# EAGLE schematic Main board V6.0 (EAGLE 6.5.0)

## Sheet 1 of 5: ACS
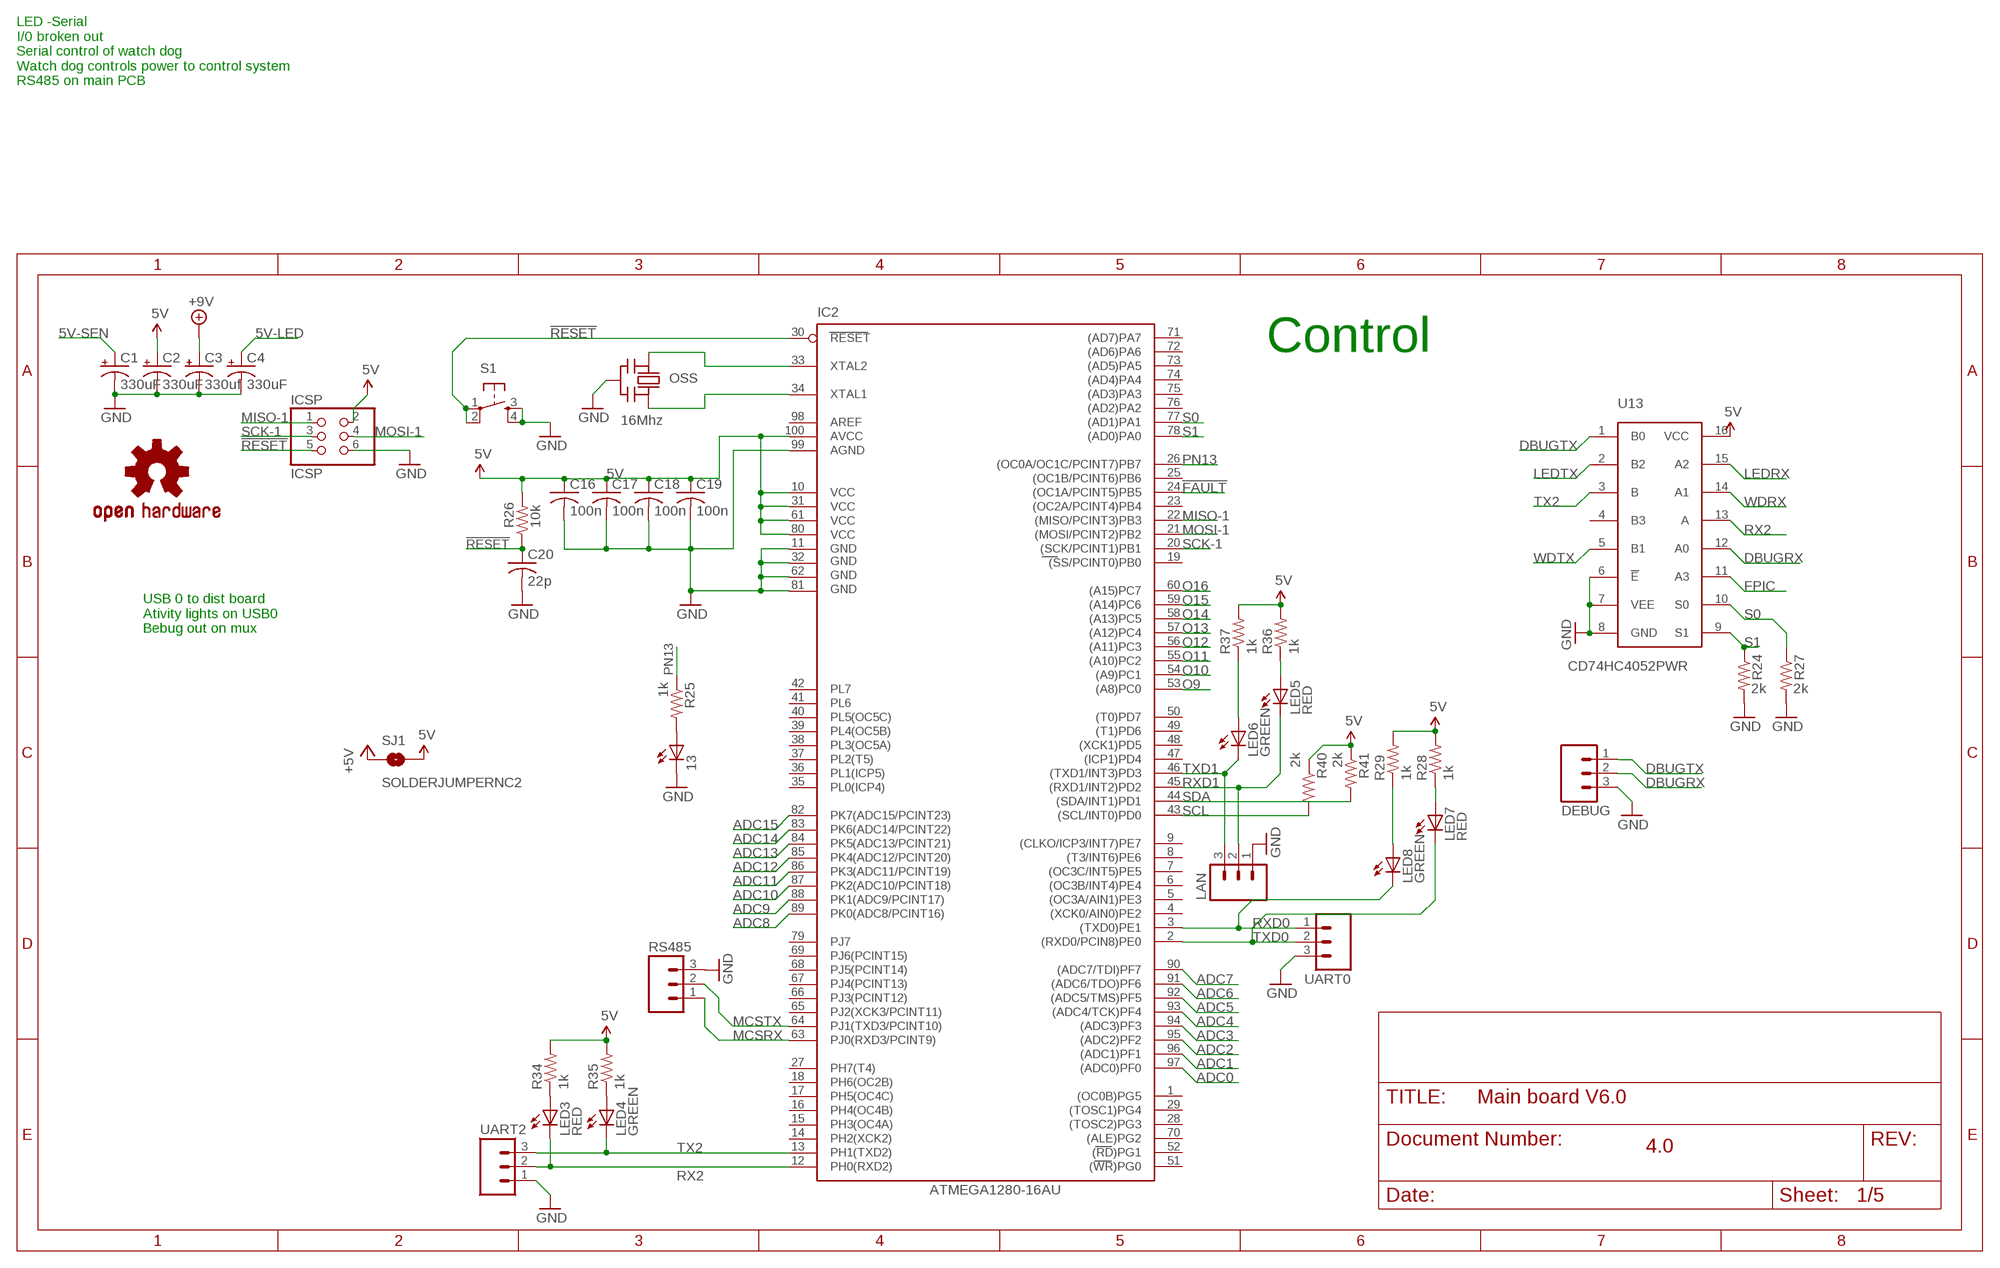
[diagram p0: schematic, sheet 1]

### Parts
13  LEDCHIP-LED0805  [CHIP-LED0805]
C1  330uF  CPOL-US140CLH-0810  [140CLH-0810]
C2  330uF  CPOL-US140CLH-0810  [140CLH-0810]
C3  330uf  CPOL-US140CLH-0810  [140CLH-0810]
C4  330uF  CPOL-US140CLH-0810  [140CLH-0810]
C16  100n  C-USC0805  [C0805]
C17  100n  C-USC0805  [C0805]
C18  100n  C-USC0805  [C0805]
C19  100n  C-USC0805  [C0805]
C20  22p  C-USC0805  [C0805]
DEBUG  M03LOCK  [1X03_LOCK]
IC2  ATMEGA1280-16AU  [TQFP100]
ICSP  ICSP  PINHD-2X3  [2X03]
LAN  M03LOCK  [1X03_LOCK]
LED3  RED  LEDCHIP-LED0805  [CHIP-LED0805]
LED4  GREEN  LEDCHIP-LED0805  [CHIP-LED0805]
LED5  RED  LEDCHIP-LED0805  [CHIP-LED0805]
LED6  GREEN  LEDCHIP-LED0805  [CHIP-LED0805]
LED7  RED  LEDCHIP-LED0805  [CHIP-LED0805]
LED8  GREEN  LEDCHIP-LED0805  [CHIP-LED0805]
OSS  16Mhz  CERMOSCILL-AWCSR  [AWCSR]
R24  2k  R-US_R0805  [R0805]
R25  1k  R-US_R0805  [R0805]
R26  10k  R-US_R0805  [R0805]
R27  2k  R-US_R0805  [R0805]
R28  1k  R-US_R0805  [R0805]
R29  1k  R-US_R0805  [R0805]
R34  1k  R-US_R0805  [R0805]
R35  1k  R-US_R0805  [R0805]
R36  1k  R-US_R0805  [R0805]
R37  1k  R-US_R0805  [R0805]
R40  2k  R-US_R0805  [R0805]
R41  2k  R-US_R0805  [R0805]
RS485  M03LOCK  [1X03_LOCK]
S1  TAC_SWITCHSMD  [TACTILE_SWITCH_SMD]
SJ1  SOLDERJUMPERNC2  [SJ_2S-NOTRACE]
U13  CD74HC4052PWR  [TSSOP-16]
U$3  OSHW-LOGOL  [OSHW-LOGO-L]
UART0  M03LOCK  [1X03_LOCK]
UART2  M03POLAR  [MOLEX-1X3]

### Nets
5V: C2.+ C16.1 C17.1 C18.1 C19.1 IC2.10(VCC) IC2.31(VCC1) IC2.61(VCC2) IC2.80(VCC3) IC2.100(AVCC) ICSP.2 R26.2 R28.2 R29.2 R34.2 R35.2 R36.2 R37.2 R40.1 R41.1 SJ1.2 U13.16(VCC) ; also sheet 4,5
5V-LED: C4.+ ; also sheet 2,5
5V-SEN: C1.+ ; also sheet 5
!FAULT: IC2.24((OC1A/PCINT5)PB5)
!RESET: C20.1 IC2.30(RESET) ICSP.5 R26.1 S1.1 S1.2
+5V: SJ1.1 ; also sheet 2
+9V: C3.+ ; also sheet 5
ADC0: IC2.97((ADC0)PF0) ; also sheet 5
ADC1: IC2.96((ADC1)PF1) ; also sheet 5
ADC2: IC2.95((ADC2)PF2) ; also sheet 5
ADC3: IC2.94((ADC3)PF3) ; also sheet 5
ADC4: IC2.93((ADC4/TCK)PF4) ; also sheet 5
ADC5: IC2.92((ADC5/TMS)PF5) ; also sheet 5
ADC6: IC2.91((ADC6/TDO)PF6) ; also sheet 5
ADC7: IC2.90((ADC7/TDI)PF7) ; also sheet 5
ADC8: IC2.89(PK0(ADC8/PCINT16)) ; also sheet 5
ADC9: IC2.88(PK1(ADC9/PCINT17)) ; also sheet 5
ADC10: IC2.87(PK2(ADC10/PCINT18)) ; also sheet 5
ADC11: IC2.86(PK3(ADC11/PCINT19)) ; also sheet 5
ADC12: IC2.85(PK4(ADC12/PCINT20)) ; also sheet 5
ADC13: IC2.84(PK5(ADC13/PCINT21)) ; also sheet 5
ADC14: IC2.83(PK6(ADC14/PCINT22)) ; also sheet 5
ADC15: IC2.82(PK7(ADC15/PCINT23)) ; also sheet 5
DBUGRX: DEBUG.2 U13.12(A0)
DBUGTX: DEBUG.1 U13.1(B0)
FPIC: U13.11(A3) ; also sheet 5
GND: 13.C C1.- C2.- C3.- C4.- C16.2 C17.2 C18.2 C19.2 C20.2 DEBUG.3 IC2.11(GND) IC2.32(GND1) IC2.62(GND2) IC2.81(GND3) IC2.99(AGND) ICSP.6 LAN.1 OSS.2(GND) R24.2 R27.2 RS485.3 S1.3 S1.4 U13.6(!E) U13.7(VEE) U13.8(GND) UART0.3 UART2.1 ; also sheet 2,3,4,5
LEDRX: U13.15(A2) ; also sheet 2
LEDTX: U13.2(B2) ; also sheet 2
MCSRX: IC2.63(PJ0(RXD3/PCINT9)) RS485.1 ; also sheet 5
MCSTX: IC2.64(PJ1(TXD3/PCINT10)) RS485.2 ; also sheet 5
MISO-1: IC2.22((MISO/PCINT3)PB3) ICSP.1
MOSI-1: IC2.21((MOSI/PCINT2)PB2) ICSP.4
N$2: 13.A R25.2
N$6: IC2.34(XTAL1) OSS.3(OUT)
N$7: IC2.33(XTAL2) OSS.1(IN)
N$52: LED8.A R29.1
N$69: LED4.A R35.1
N$71: LED3.A R34.1
N$73: LED7.A R28.1
N$74: LED6.A R37.1
N$75: LED5.A R36.1
O9: IC2.53((A8)PC0)
O10: IC2.54((A9)PC1)
O11: IC2.55((A10)PC2)
O12: IC2.56((A11)PC3)
O13: IC2.57((A12)PC4)
O14: IC2.58((A13)PC5)
O15: IC2.59((A14)PC6)
O16: IC2.60((A15)PC7)
PN13: IC2.26((OC0A/OC1C/PCINT7)PB7) R25.1 ; also sheet 4
RX2: IC2.12(PH0(RXD2)) LED3.C U13.13(A) UART2.2
RXD0: IC2.3((TXD0)PE1) LED8.C UART0.1 ; also sheet 5
RXD1: IC2.45((RXD1/INT2)PD2) LAN.2 LED5.C ; also sheet 3
S0: IC2.77((AD1)PA1) R27.1 U13.10(S0)
S1: IC2.78((AD0)PA0) R24.1 U13.9(S1)
SCK-1: IC2.20((SCK/PCINT1)PB1) ICSP.3
SCL: IC2.43((SCL/INT0)PD0) R40.2 ; also sheet 5
SDA: IC2.44((SDA/INT1)PD1) R41.2 ; also sheet 5
TX2: IC2.13(PH1(TXD2)) LED4.C U13.3(B) UART2.3
TXD0: IC2.2((RXD0/PCIN8)PE0) LED7.C UART0.2 ; also sheet 5
TXD1: IC2.46((TXD1/INT3)PD3) LAN.3 LED6.C ; also sheet 3
WDRX: U13.14(A1) ; also sheet 4
WDTX: U13.5(B1) ; also sheet 4
Unconnected: IC2.1((OC0B)PG5) IC2.4((XCK0/AIN0)PE2) IC2.5((OC3A/AIN1)PE3) IC2.6((OC3B/INT4)PE4) IC2.7((OC3C/INT5)PE5) IC2.8((T3/INT6)PE6) IC2.9((CLKO/ICP3/INT7)PE7) IC2.14(PH2(XCK2)) IC2.15(PH3(OC4A)) IC2.16(PH4(OC4B)) IC2.17(PH5(OC4C)) IC2.18(PH6(OC2B)) IC2.19((SS/PCINT0)PB0) IC2.23((OC2A/PCINT4)PB4) IC2.25((OC1B/PCINT6)PB6) IC2.27(PH7(T4)) IC2.28((TOSC2)PG3) IC2.29((TOSC1)PG4) IC2.35(PL0(ICP4)) IC2.36(PL1(ICP5)) IC2.37(PL2(T5)) IC2.38(PL3(OC5A)) IC2.39(PL4(OC5B)) IC2.40(PL5(OC5C)) IC2.41(PL6) IC2.42(PL7) IC2.47((ICP1)PD4) IC2.48((XCK1)PD5) IC2.49((T1)PD6) IC2.50((T0)PD7) IC2.51((WR)PG0) IC2.52((RD)PG1) IC2.65(PJ2(XCK3/PCINT11)) IC2.66(PJ3(PCINT12)) IC2.67(PJ4(PCINT13)) IC2.68(PJ5(PCINT14)) IC2.69(PJ6(PCINT15)) IC2.70((ALE)PG2) IC2.71((AD7)PA7) IC2.72((AD6)PA6) IC2.73((AD5)PA5) IC2.74((AD4)PA4) IC2.75((AD3)PA3) IC2.76((AD2)PA2) IC2.79(PJ7) IC2.98(AREF) U13.4(B3)

### Notes on the sheet
- LED -Serial
  I/0 broken out
  Serial control of watch dog
  Watch dog controls power to control system
  RS485 on main PCB
- Control
- USB 0 to dist board
  Ativity lights on USB0
  Bebug out on mux
- 4.0

## Sheet 2 of 5
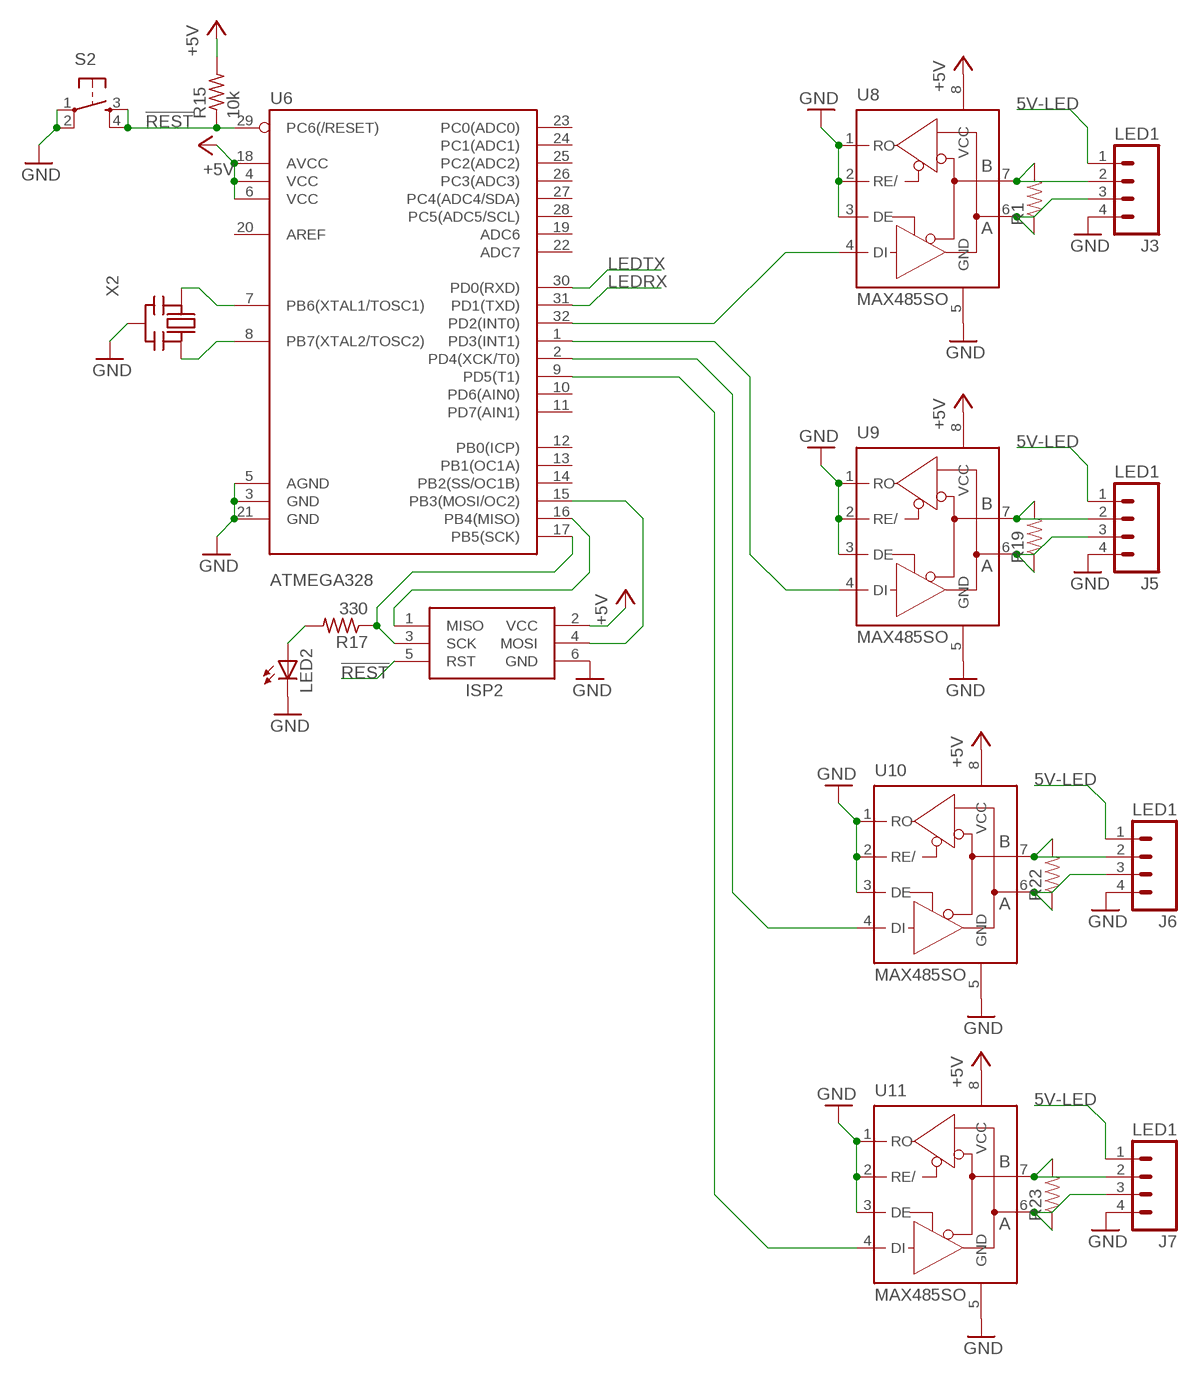
[diagram p1: schematic, sheet 2]

### Parts
ISP2  AVRISP-6  [AVRISP]
J3  LED1  EUROMAG-4  [M4]
J5  LED1  EUROMAG-4  [M4]
J6  LED1  EUROMAG-4  [M4]
J7  LED1  EUROMAG-4  [M4]
LED2  LEDCHIPLED_0805  [CHIPLED_0805]
R1  RESISTOR0805-RES  [0805]
R15  10k  R-US_R0805  [R0805]
R17  330  R-US_R0805  [R0805]
R19  RESISTOR0805-RES  [0805]
R22  RESISTOR0805-RES  [0805]
R23  RESISTOR0805-RES  [0805]
S2  TAC_SWITCHPTH  [TACTILE-PTH]
U6  ATMEGA328  ATMEGA168  [TQFP32-08]
U8  MAX485SO  [SO08]
U9  MAX485SO  [SO08]
U10  MAX485SO  [SO08]
U11  MAX485SO  [SO08]
X2  CERMOSCILL-AWCSR  [AWCSR]

### Nets
5V-LED: J3.1 J5.1 J6.1 J7.1 ; also sheet 1,5
!REST: ISP2.5(RST) R15.1 S2.3 S2.4 U6.29(PC6(/RESET))
+5V: ISP2.2(VCC) R15.2 U6.4(VCC) U6.6(VCC) U6.18(AVCC) U8.8(VCC) U9.8(VCC) U10.8(VCC) U11.8(VCC) ; also sheet 1
DFDFD: ISP2.1(MISO) U6.16(PB4(MISO))
GND: ISP2.6(GND) J3.4 J5.4 J6.4 J7.4 LED2.C S2.1 S2.2 U6.3(GND) U6.5(AGND) U6.21(GND) U8.1(RO) U8.2(RE/) U8.3(DE) U8.5(GND) U9.1(RO) U9.2(RE/) U9.3(DE) U9.5(GND) U10.1(RO) U10.2(RE/) U10.3(DE) U10.5(GND) U11.1(RO) U11.2(RE/) U11.3(DE) U11.5(GND) X2.2(GND) ; also sheet 1,3,4,5
LEDRX: U6.31(PD1(TXD)) ; also sheet 1
LEDTX: U6.30(PD0(RXD)) ; also sheet 1
N$21: ISP2.3(SCK) R17.1 U6.17(PB5(SCK))
N$22: ISP2.4(MOSI) U6.15(PB3(MOSI/OC2))
N$23: LED2.A R17.2
N$24: U6.7(PB6(XTAL1/TOSC1)) X2.1(IN)
N$25: U6.8(PB7(XTAL2/TOSC2)) X2.3(OUT)
N$28: J3.2 R1.2 U8.7(B)
N$29: J3.3 R1.1 U8.6(A)
N$30: J5.2 R19.2 U9.7(B)
N$31: J5.3 R19.1 U9.6(A)
N$32: J6.2 R22.2 U10.7(B)
N$34: J6.3 R22.1 U10.6(A)
N$35: J7.2 R23.2 U11.7(B)
N$36: J7.3 R23.1 U11.6(A)
N$37: U6.32(PD2(INT0)) U8.4(DI)
N$38: U6.1(PD3(INT1)) U9.4(DI)
N$39: U6.2(PD4(XCK/T0)) U10.4(DI)
N$41: U6.9(PD5(T1)) U11.4(DI)
Unconnected: U6.10(PD6(AIN0)) U6.11(PD7(AIN1)) U6.12(PB0(ICP)) U6.13(PB1(OC1A)) U6.14(PB2(SS/OC1B)) U6.19(ADC6) U6.20(AREF) U6.22(ADC7) U6.23(PC0(ADC0)) U6.24(PC1(ADC1)) U6.25(PC2(ADC2)) U6.26(PC3(ADC3)) U6.27(PC4(ADC4/SDA)) U6.28(PC5(ADC5/SCL))

## Sheet 3 of 5: CTS
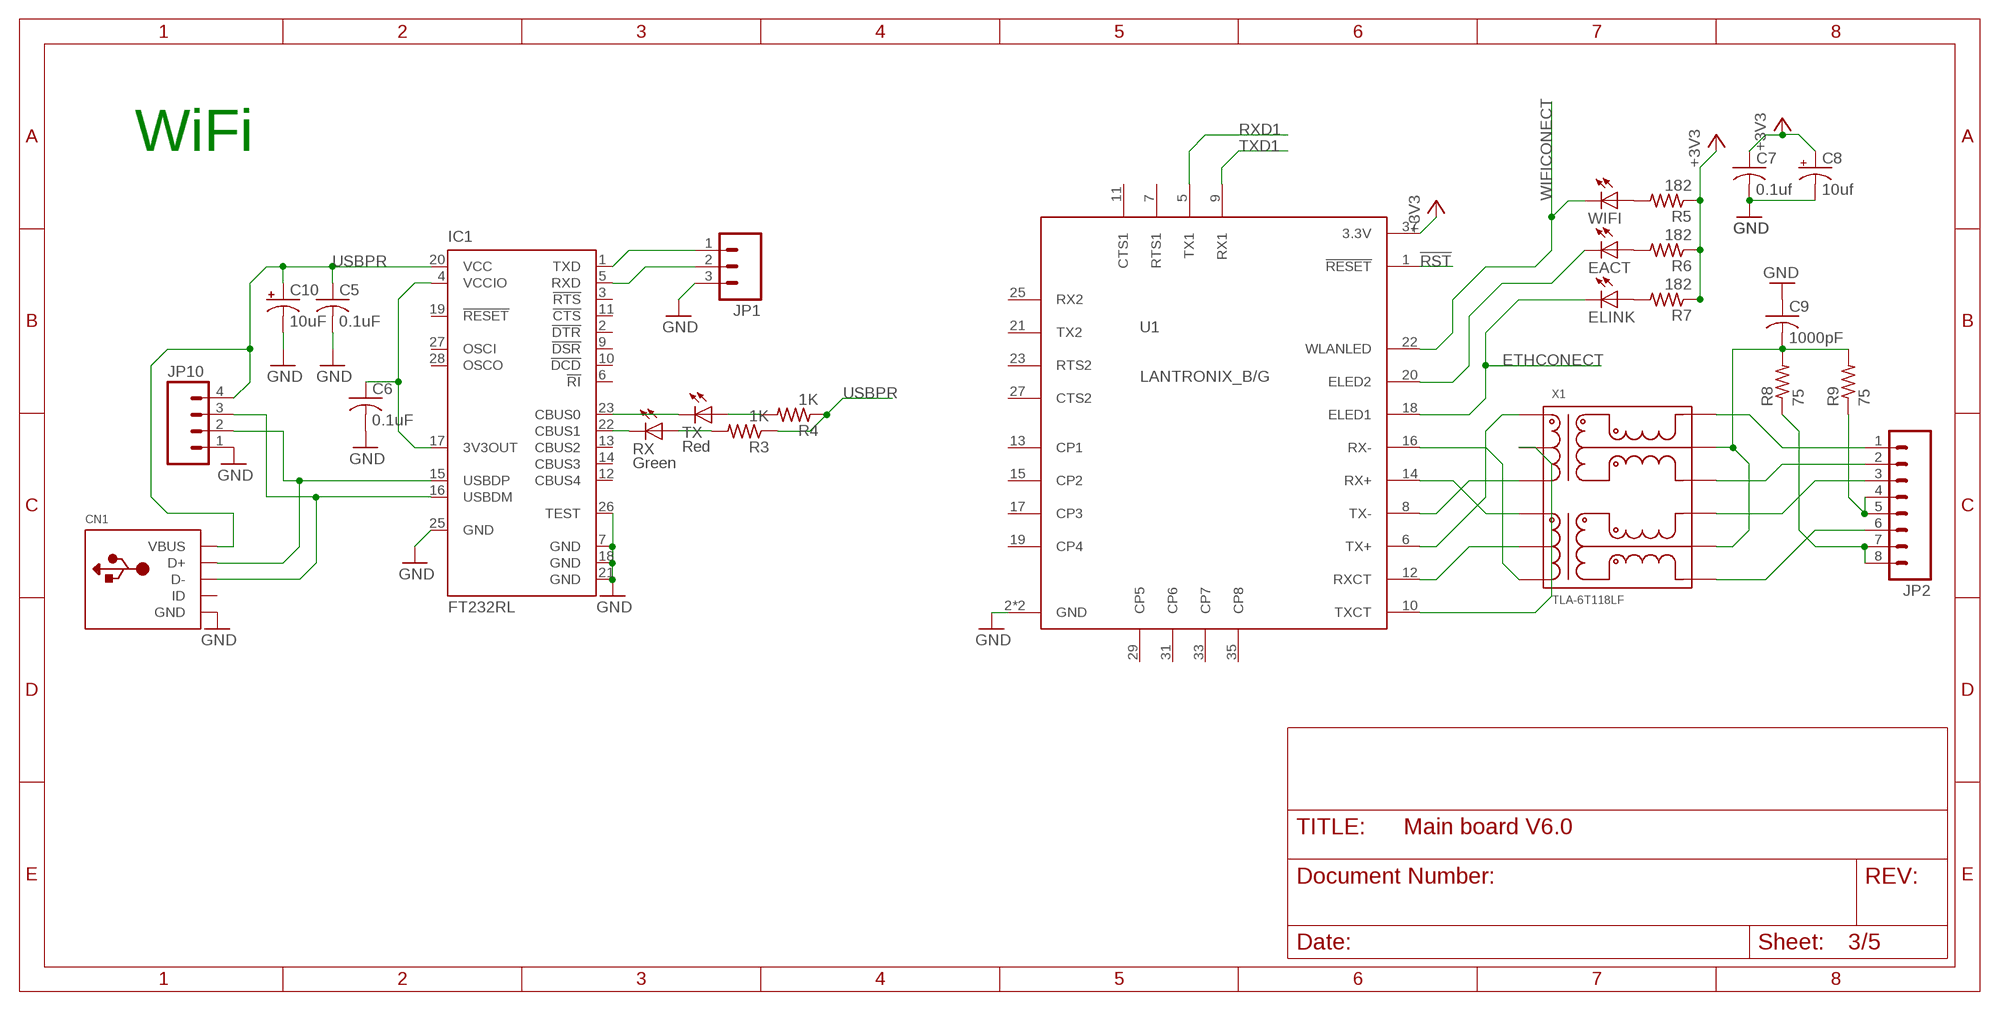
[diagram p2: schematic, sheet 3]

### Parts
C5  0.1uF  C-USC0805K  [C0805K]
C6  0.1uF  C-USC0805K  [C0805K]
C7  0.1uf  C-USC0805K  [C0805K]
C8  10uf  CAP_POL3528  [EIA3528]
C9  1000pF  C-USC1812  [C1812]
C10  10uF  CAP_POL3528-KIT  [EIA3528-KIT]
CN1  USBMINIB  [USB-MINIB]
EACT  LEDCHIP-LED0805  [CHIP-LED0805]
ELINK  LEDCHIP-LED0805  [CHIP-LED0805]
IC1  FT232RL  [SSOP28]
JP1  M03POLAR  [MOLEX-1X3]
JP2  M08LOCK  [1X08_LOCK]
JP10  M04POLAR  [MOLEX-1X4]
R3  1K  R-US_R0805  [R0805]
R4  1K  R-US_R0805  [R0805]
R5  182  R-US_R0805  [R0805]
R6  182  R-US_R0805  [R0805]
R7  182  R-US_R0805  [R0805]
R8  75  R-US_R0805  [R0805]
R9  75  R-US_R0805  [R0805]
RX  Green  LEDCHIP-LED0805  [CHIP-LED0805]
TX  Red  LEDCHIP-LED0805  [CHIP-LED0805]
U1  LANTRONIX_B/G  LANTRONIX_A/B  [LANA/BTH]
WIFI  LEDCHIP-LED0805  [CHIP-LED0805]
X1  TLA-6T118LF  [SO-16MOD]

### Nets
!RST: U1.1(!RESET)
+3V3: C7.1 C8.A(+) R5.1 R6.1 R7.1 U1.37(3.3V) ; also sheet 5
ETHCONECT: ELINK.C U1.18(ELED1)
GND: C5.2 C6.2 C7.2 C8.C(-) C9.1 C10.C(-) CN1.GND IC1.7(GND) IC1.18(GND) IC1.21(GND) IC1.25(GND) IC1.26(TEST) JP1.3 JP10.1 U1.2(GND) U1.39(GND) ; also sheet 1,2,4,5
N$1: IC1.23(CBUS0) TX.C
N$3: IC1.22(CBUS1) RX.C
N$4: R3.2 RX.A
N$5: CN1.D+ IC1.15(USBDP) JP10.2
N$8: CN1.D- IC1.16(USBDM) JP10.3
N$9: R4.2 TX.A
N$11: IC1.1(TXD) JP1.1
N$12: C6.1 IC1.4(VCCIO) IC1.17(3V3OUT)
N$53: U1.8(TX-) X1.3
N$54: U1.6(TX+) X1.1
N$55: U1.14(RX+) X1.6
N$56: U1.16(RX-) X1.8
N$57: U1.12(RXCT) X1.7
N$58: U1.10(TXCT) X1.2
N$60: JP2.7 JP2.8 R8.1
N$61: JP2.1 X1.16
N$62: JP2.2 X1.14
N$63: JP2.3 X1.11
N$64: JP2.6 X1.9
N$65: C9.2 R8.2 R9.2 X1.10 X1.15
N$66: ELINK.A R7.2
N$67: EACT.A R6.2
N$68: R5.2 WIFI.A
N$70: EACT.C U1.20(ELED2)
N$72: JP2.4 JP2.5 R9.1
N$109: IC1.5(RXD) JP1.2
RXD1: U1.5(TX1) ; also sheet 1
TXD1: U1.9(RX1) ; also sheet 1
USBPR: C5.1 C10.A(+) CN1.VBUS IC1.20(VCC) JP10.4 R3.1 R4.1
WIFICONECT: U1.22(WLANLED) WIFI.C
Unconnected: CN1.ID IC1.2(!DTR) IC1.3(!RTS) IC1.6(!RI) IC1.9(!DSR) IC1.10(!DCD) IC1.11(!CTS) IC1.12(CBUS4) IC1.13(CBUS2) IC1.14(CBUS3) IC1.19(!RESET) IC1.27(OSCI) IC1.28(OSCO) U1.7(RTS1) U1.11(CTS1) U1.13(CP1) U1.15(CP2) U1.17(CP3) U1.19(CP4) U1.21(TX2) U1.23(RTS2) U1.25(RX2) U1.27(CTS2) U1.29(CP5) U1.31(CP6) U1.33(CP7) U1.35(CP8)

### Notes on the sheet
- WiFi

## Sheet 4 of 5: WDS
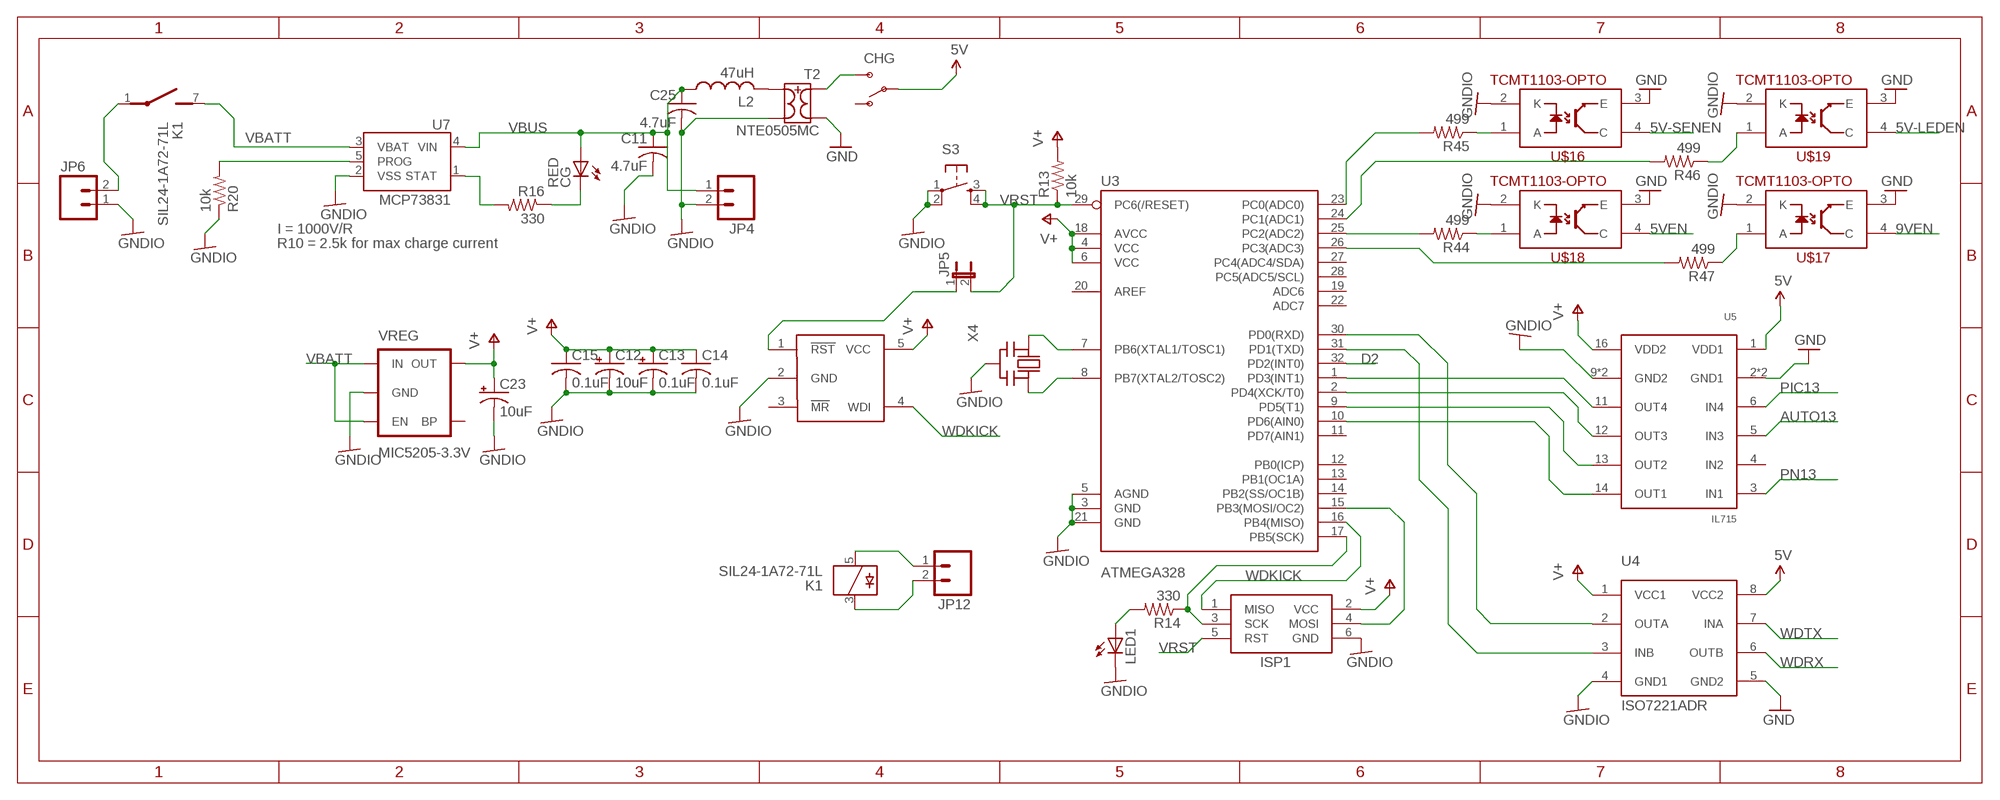
[diagram p3: schematic, sheet 4]

### Parts
C11  4.7uF  C-USC0603  [C0603]
C12  10uF  CPOL-USCT3528  [CT3528]
C13  0.1uF  CPOL-USCT3528  [CT3528]
C14  0.1uF  C-USC0805  [C0805]
C15  0.1uF  C-USC0805  [C0805]
C23  10uF  CPOL-USCT3528  [CT3528]
C25  4.7uF  C-USC0603  [C0603]
CG  RED  LEDSML0805  [SML0805]
CHG  SWITCH-SPSTPTH  [SWITCH-SPDT]
ISP1  AVRISP-6  [AVRISP]
JP4  M021X02_NO_SILK  [1X02_NO_SILK]
JP5  JUMPER-2PTH_LOCK  [1X02_LOCK]
JP6  M02-JST-2MM-SMT  [JST-2-SMD]
JP12  M02POLAR_LOCK  [MOLEX-1X2_LOCK]
K1  SIL24-1A72-71L  35701331  [REED]
L2  47uH  L-USL2012C  [L2012C]
LED1  LEDCHIPLED_0805  [CHIPLED_0805]
R13  10k  R-US_R0805  [R0805]
R14  330  R-US_R0805  [R0805]
R16  330  R-US_R0805  [R0805]
R20  10k  R-US_R0805  [R0805]
R44  499  R-US_R0805  [R0805]
R45  499  R-US_R0805  [R0805]
R46  499  R-US_R0805  [R0805]
R47  499  R-US_R0805  [R0805]
S3  TAC_SWITCHPTH  [TACTILE-PTH]
T2  NTE0505MC  [SO-8FT]
U3  ATMEGA328  ATMEGA168  [TQFP32-08]
U4  ISO7221ADR  [SOIC-8]
U5  IL715  [S016]
U7  MCP73831  [SOT23-5]
U20  MAX823  [SOT23-5L]
U$16  TCMT1103-OPTO  [SSOP-4]
U$17  TCMT1103-OPTO  [SSOP-4]
U$18  TCMT1103-OPTO  [SSOP-4]
U$19  TCMT1103-OPTO  [SSOP-4]
VREG  MIC5205-3.3V  V_REG_LDOSMD  [SOT23-5]
X4  CERMOSCILL-CSTCRG  [CSTCR-G]

### Nets
5V: CHG.2(P) U4.8(VCC2) U5.1(VDD1) ; also sheet 1,5
5V-LEDEN: U$19.4(C) ; also sheet 5
5V-SENEN: U$16.4(C) ; also sheet 5
5VEN: U$18.4(C) ; also sheet 5
9VEN: U$17.4(C) ; also sheet 5
AUTO13: U5.5(IN3) ; also sheet 5
D2: U3.32(PD2(INT0))
GND: T2.1 U4.5(GND2) U5.2(GND1) U5.8(GND1) U$16.3(E) U$17.3(E) U$18.3(E) U$19.3(E) ; also sheet 1,2,3,5
GNDIO: C11.2 C12.- C13.- C14.2 C15.2 C23.- C25.2 ISP1.6(GND) JP4.2 JP6.1 LED1.C R20.1 S3.1 S3.2 T2.7 U3.3(GND) U3.5(AGND) U3.21(GND) U4.4(GND1) U5.9(GND2) U5.15(GND2) U7.2(VSS) U20.2(GND) U$16.2(K) U$17.2(K) U$18.2(K) U$19.2(K) VREG.2(GND) X4.2(GND)
N$16: U3.31(PD1(TXD)) U4.3(INB)
N$18: JP5.1 U20.1(!RST)
N$19: ISP1.3(SCK) R14.1 U3.17(PB5(SCK))
N$20: U3.30(PD0(RXD)) U4.2(OUTA)
N$27: ISP1.4(MOSI) U3.15(PB3(MOSI/OC2))
N$33: R45.2 U3.23(PC0(ADC0))
N$40: L2.2 T2.8
N$42: LED1.A R14.2
N$44: CG.C R16.1
N$45: JP12.1 K1.5
N$46: JP6.2 K1.1(2:P)
N$47: U3.7(PB6(XTAL1/TOSC1)) X4.1(IN)
N$48: U3.8(PB7(XTAL2/TOSC2)) X4.3(OUT)
N$49: U3.2(PD4(XCK/T0)) U5.12(OUT3)
N$50: U3.9(PD5(T1)) U5.13(OUT2)
N$51: U3.10(PD6(AIN0)) U5.14(OUT1)
N$59: CHG.3(S) T2.3
N$76: U3.1(PD3(INT1)) U5.11(OUT4)
N$77: R45.1 U$16.1(A)
N$78: R46.2 U3.24(PC1(ADC1))
N$82: R46.1 U$19.1(A)
N$83: R44.2 U3.25(PC2(ADC2))
N$84: R44.1 U$18.1(A)
N$85: R47.2 U3.26(PC3(ADC3))
N$86: R47.1 U$17.1(A)
N$91: JP12.2 K1.3
PIC13: U5.6(IN4) ; also sheet 5
PN13: U5.3(IN1) ; also sheet 1
PROG: R20.2 U7.5(PROG)
STAT: R16.2 U7.1(STAT)
V+: C12.+ C13.+ C14.1 C15.1 C23.+ ISP1.2(VCC) R13.2 U3.4(VCC) U3.6(VCC) U3.18(AVCC) U4.1(VCC1) U5.16(VDD2) U20.5(VCC) VREG.5(OUT)
VBATT: K1.7(2:S) U7.3(VBAT) VREG.1(IN) VREG.3(EN)
VBUS: C11.1 C25.1 CG.A JP4.1 L2.1 U7.4(VIN)
VRST: ISP1.5(RST) JP5.2 R13.1 S3.3 S3.4 U3.29(PC6(/RESET))
WDKICK: ISP1.1(MISO) U3.16(PB4(MISO)) U20.4(WDI)
WDRX: U4.6(OUTB) ; also sheet 1
WDTX: U4.7(INA) ; also sheet 1
Unconnected: CHG.1(O) U3.11(PD7(AIN1)) U3.12(PB0(ICP)) U3.13(PB1(OC1A)) U3.14(PB2(SS/OC1B)) U3.19(ADC6) U3.20(AREF) U3.22(ADC7) U3.27(PC4(ADC4/SDA)) U3.28(PC5(ADC5/SCL)) U5.4(IN2) U20.3(!MR) VREG.4(BP)

### Notes on the sheet
- I = 1000V/R
- R10 = 2.5k for max charge current

## Sheet 5 of 5: connectors
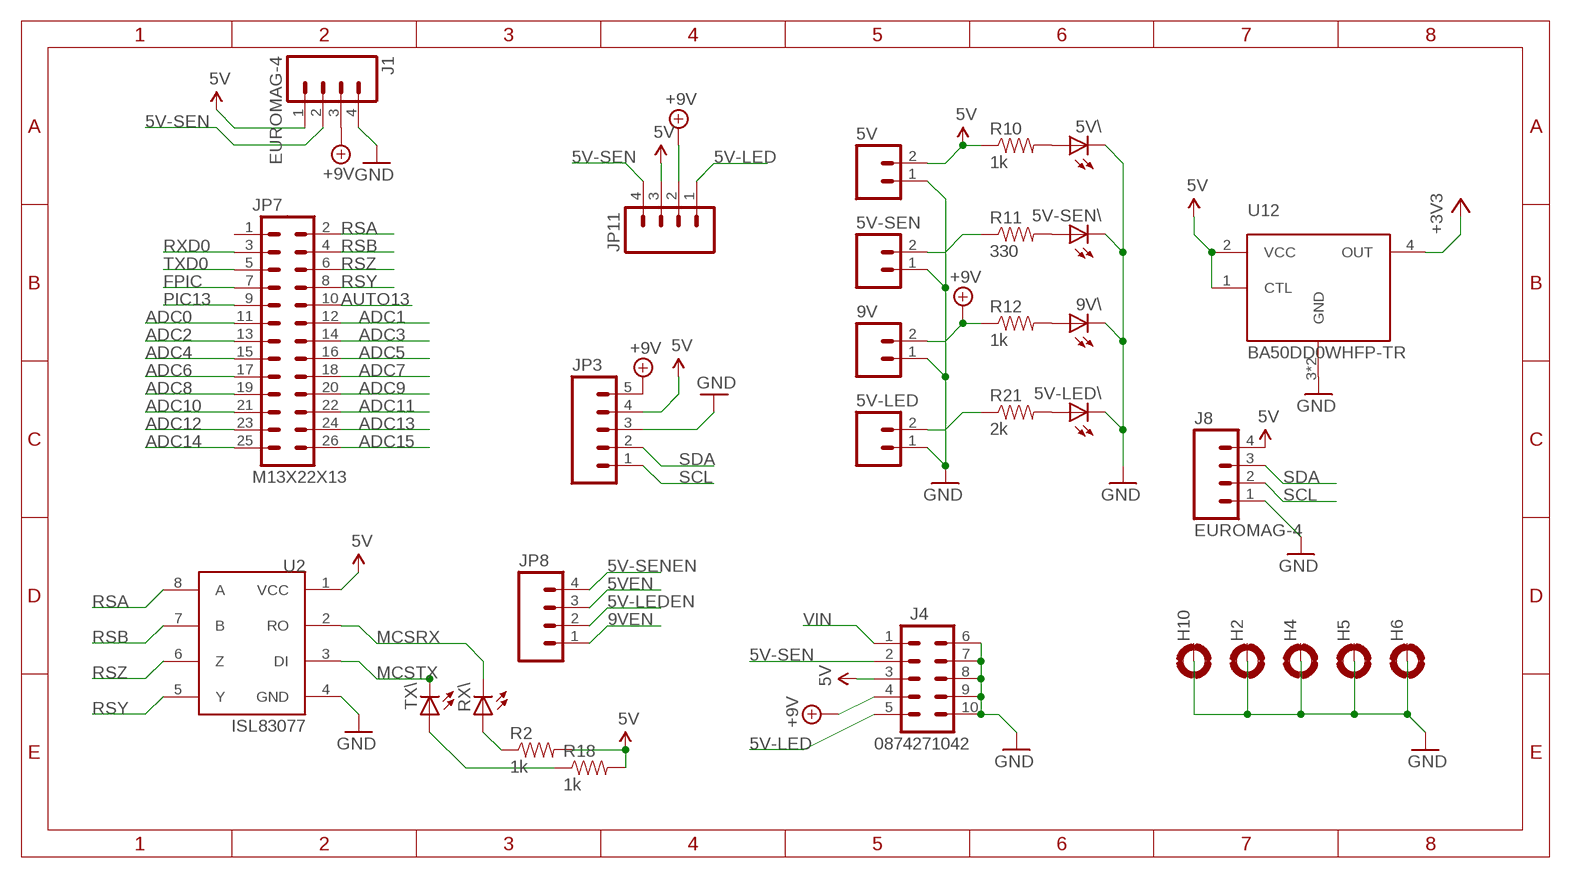
[diagram p4: schematic, sheet 5]

### Parts
5V  EUROMAG-290DEG  [M2]
5V-LED  EUROMAG-290DEG  [M2]
5V-LED\  LEDCHIP-LED0805  [CHIP-LED0805]
5V-SEN  EUROMAG-290DEG  [M2]
5V-SEN\  LEDCHIP-LED0805  [CHIP-LED0805]
5V\  LEDCHIP-LED0805  [CHIP-LED0805]
9V  EUROMAG-290DEG  [M2]
9V\  LEDCHIP-LED0805  [CHIP-LED0805]
H2  MOUNT-PAD-ROUND2.8  [2,8-PAD]
H4  MOUNT-PAD-ROUND2.8  [2,8-PAD]
H5  MOUNT-PAD-ROUND2.8  [2,8-PAD]
H6  MOUNT-PAD-ROUND2.8  [2,8-PAD]
H10  MOUNT-PAD-ROUND2.8  [2,8-PAD]
J1  EUROMAG-4  [M4]
J4  0874271042  [0874271042]
J8  EUROMAG-4  [M4]
JP3  M05LOCK_LONGPADS  [1X05_LOCK_LONGPADS]
JP7  M13X22X13  [2X13]
JP8  M04LOCK  [1X04_LOCK]
JP11  M04POLAR  [MOLEX-1X4]
R2  1k  RESISTOR0805-RES  [0805]
R10  1k  RESISTOR0805-RES  [0805]
R11  330  RESISTOR0805-RES  [0805]
R12  1k  RESISTOR0805-RES  [0805]
R18  1k  RESISTOR0805-RES  [0805]
R21  2k  RESISTOR0805-RES  [0805]
RX\  LEDCHIP-LED0805  [CHIP-LED0805]
TX\  LEDCHIP-LED0805  [CHIP-LED0805]
U2  ISL83077  [SO08]
U12  BA50DD0WHFP-TR  [HRP5]

### Nets
5V: 5V.2 J1.1 J4.3 J8.4 JP3.4 JP11.3 R2.2 R10.1 R18.2 U2.1(VCC) U12.1(CTL) U12.2(VCC) ; also sheet 1,4
5V-LED: 5V-LED.2 J4.5 JP11.1 R21.1 ; also sheet 1,2
5V-LEDEN: JP8.2 ; also sheet 4
5V-SEN: 5V-SEN.2 J1.2 J4.2 JP11.4 R11.1 ; also sheet 1
5V-SENEN: JP8.4 ; also sheet 4
5VEN: JP8.3 ; also sheet 4
9VEN: JP8.1 ; also sheet 4
+3V3: U12.4(OUT) ; also sheet 3
+9V: 9V.2 J1.3 J4.4 JP3.5 JP11.2 R12.1 ; also sheet 1
ADC0: JP7.11 ; also sheet 1
ADC1: JP7.12 ; also sheet 1
ADC2: JP7.13 ; also sheet 1
ADC3: JP7.14 ; also sheet 1
ADC4: JP7.15 ; also sheet 1
ADC5: JP7.16 ; also sheet 1
ADC6: JP7.17 ; also sheet 1
ADC7: JP7.18 ; also sheet 1
ADC8: JP7.19 ; also sheet 1
ADC9: JP7.20 ; also sheet 1
ADC10: JP7.21 ; also sheet 1
ADC11: JP7.22 ; also sheet 1
ADC12: JP7.23 ; also sheet 1
ADC13: JP7.24 ; also sheet 1
ADC14: JP7.25 ; also sheet 1
ADC15: JP7.26 ; also sheet 1
AUTO13: JP7.10 ; also sheet 4
FPIC: JP7.7 ; also sheet 1
GND: 5V-LED.1 5V-LED\.C 5V-SEN.1 5V-SEN\.C 5V.1 5V\.C 9V.1 9V\.C H2.B2,8(MOUNT) H4.B2,8(MOUNT) H5.B2,8(MOUNT) H6.B2,8(MOUNT) H10.B2,8(MOUNT) J1.4 J4.6 J4.7 J4.8 J4.9 J4.10 J8.1 JP3.3 U2.4(GND) U12.3(GND) U12.G(GND) ; also sheet 1,2,3,4
MCSRX: RX\.C U2.2(RO) ; also sheet 1
MCSTX: TX\.C U2.3(DI) ; also sheet 1
N$10: 5V\.A R10.2
N$13: R2.1 RX\.A
N$14: R18.1 TX\.A
N$17: 5V-SEN\.A R11.2
N$26: 9V\.A R12.2
N$43: 5V-LED\.A R21.2
PIC13: JP7.9 ; also sheet 4
RSA: JP7.2 U2.8(A)
RSB: JP7.4 U2.7(B)
RSY: JP7.8 U2.5(Y)
RSZ: JP7.6 U2.6(Z)
RXD0: JP7.3 ; also sheet 1
SCL: J8.2 JP3.1 ; also sheet 1
SDA: J8.3 JP3.2 ; also sheet 1
TXD0: JP7.5 ; also sheet 1
VIN: J4.1
Unconnected: JP7.1

## Library data of the parts
5V 5V-LED 5V-SEN 9V = NASA_LIB:EUROMAG-2
5V-LED\ 5V-SEN\ 5V\ 9V\ 13 EACT ELINK LED1-LED8 RX RX\ TX TX\ WIFI = adafruit:LED: LED
C1-C4 C12 C13 C23 = adafruit:CPOL-US: POLARIZED CAPACITOR, American symbol
C5-C7 C9 C14-C20 = adafruit:C-US: CAPACITOR, American symbol
C8 C10 = SparkFun:CAP_POL: Capacitor Polarized These are standard SMD and PTH capacitors. Normally 10uF, 47uF, and 100uF in electrolytic and tantalum varieties. Always verify the external diameter of the through hole cap, it varies with capacity, voltage, and manufacturer. The EIA devices should be standard.
C11 C25 = resistor:C-US: CAPACITOR, American symbol
CG = led:LED: LED
CHG = SparkFun:SWITCH-SPST: SPST Switch Simple slide switch. Spark Fun Electronics SKU : COM-00102
CN1 = adafruit:USB: USB Connectors USBMINIB - Surface Mount Female Mini-B USB Connector 4UConnector: 06564 By microbuilder.eu Thru-hole RA Female Mini-B USB Connector 4UConnector: 18732 By ladyada.net
DEBUG JP1 LAN RS485 UART0 UART2 = SparkFun:M03: Header 3 Standard 3-pin 0.1" header. Use with straight break away headers (SKU : PRT-00116), right angle break away headers (PRT-00553), swiss pins (PRT-00743), machine pins (PRT-00117), and female headers (PRT-00115). Molex polarized connector foot print use with SKU : PRT-08232 with associated crimp pins and housings.
H2 H4-H6 H10 = holes:MOUNT-PAD-ROUND: MOUNTING PAD, round
IC1 = ftdichip:FT232R: Source: http://www.ftdichip.com/Documents/DataSheets/DS_FT232R_v104.pdf; MPN: FT232RL; OC_FARNELL: 1146032; OC_NEWARK: 91K9918
IC2 = atmel-2005:ATMEGA*: MICROCONTROLLER 64/128/256 Kbytes FLASH 4 Kbytes EEPROM 8 Kbytes SRAM 86 General Purpose I/O pins 12-channels16-bit PWM 4 x Serial USARTs 16-channels 10-bit A/D
ICSP = pinhead:PINHD-2X3: PIN HEADER
ISP1 ISP2 = adafruit:AVRISP: AVR ISP HEADER Standard 6 pin header for AVR programming
J1 J3 J5-J8 = NASA_LIB:EUROMAG-4
J4 = NASA_LIB:0874271042
JP2 = SparkFun-Connectors:M08: Header 8 Standard 8-pin 0.1" header. Use with straight break away headers (SKU : PRT-00116), right angle break away headers (PRT-00553), swiss pins (PRT-00743), machine pins (PRT-00117), and female headers (PRT-00115).
JP3 = SparkFun:M05: Header 5 Standard 5-pin 0.1" header. Use with straight break away headers (SKU : PRT-00116), right angle break away headers (PRT-00553), swiss pins (PRT-00743), machine pins (PRT-00117), and female headers (PRT-00115). Molex polarized connector foot print use with SKU : PRT-08230 with associated crimp pins and housings.
JP4 JP6 JP12 = SparkFun:M02: Header 2 Standard 2-pin 0.1" header. Use with straight break away headers (SKU : PRT-00116), right angle break away headers (PRT-00553), swiss pins (PRT-00743), machine pins (PRT-00117), and female headers (PRT-00115). Molex polarized connector foot print use with SKU : PRT-08233 with associated crimp pins and housings.
JP5 = SparkFun:JUMPER-2: Jumper Basic 0.1" spaced jumper. Use with breakaway headers.
JP7 = SparkFun-Connectors:M13X2: 0.1" spaced headers
JP8 = SparkFun-Connectors:M04: Header 4 Standard 4-pin 0.1" header. Use with straight break away headers (SKU : PRT-00116), right angle break away headers (PRT-00553), swiss pins (PRT-00743), machine pins (PRT-00117), and female headers (PRT-00115). Molex polarized connector foot print use with SKU : PRT-08231 with associated crimp pins and housings. 1MM SMD Version SKU: PRT-10208
JP10 JP11 = SparkFun:M04: Header 4 Standard 4-pin 0.1" header. Use with straight break away headers (SKU : PRT-00116), right angle break away headers (PRT-00553), swiss pins (PRT-00743), machine pins (PRT-00117), and female headers (PRT-00115). Molex polarized connector foot print use with SKU : PRT-08231 with associated crimp pins and housings. 1MM SMD Version SKU: PRT-10208
K1 = relay:35701331: RELAY reed, 1 x norm. open with polarity; OC_FARNELL: unknown; OC_NEWARK: unknown
L2 = rcl:L-US: INDUCTOR, American symbol
OSS X2 X4 = adafruit:CERMOSCILL: Ceramic oscillator with built in capacitors such as ZTT-12MHz http://www.ladyada.net/library/eagle
R1 R2 R18 R19 R22 R23 = SparkFun-Passives:RESISTOR: Resistor Basic schematic elements and footprints for 0603, 1206, and PTH resistors.
R3-R9 R24-R29 R34-R37 R40 R41 = adafruit:R-US_: RESISTOR, American symbol
R10-R12 R21 = SparkFun:RESISTOR: Resistor Basic schematic elements and footprints for 0603, 1206, and PTH resistors.
R13-R17 R20 R44-R47 = resistor:R-US_: RESISTOR, American symbol
S1-S3 = SparkFun:TAC_SWITCH: Momentary Switch Button commonly used for reset or general input. Spark Fun Electronics SKU : COM-00097
SJ1 = SparkFun-Passives:SOLDERJUMPER: Solder Jumper Standard SMD solder jumper. Used to automate production. Two varients : Normally Open and Normally Closed are the same, but have different paste layers. NC will have a large amount of paste and should jumper during reflow.
T2 = EmEndev:NTE0505MC
U1 = NASA_LIB:LANTRONIX_A/B
U2 = NASA_LIB:ISL83077
U3 U6 = SparkFun:ATMEGA168
U4 = Gasbarre:ISO7221ADR
U5 = NASA_LIB:IL715
U7 = SparkFun:MCP73831: Microchip's MCP73831 Miniature single cell, fully integrated Li-Ion, Li-polymer charge management controller http://ww1.microchip.com/downloads/en/DeviceDoc/21984a.pdf
U8-U11 = NASA_LIB:MAX485
U12 = NASA_LIB:BA50DD0WHFP-TR
U13 = NASA_LIB:CD74HC4052PWR
U20 = NASA_LIB:MAX823
U$3 = SparkFun:OSHW-LOGO: Open Source Hardware Logo This logo indicates the piece of hardware it is found on incorporates a OSHW license and/or adheres to the definition of open source hardware found here: http://freedomdefined.org/OSHW
U$16-U$19 = SparkFun:TCMT1103-OPTO
VREG = SparkFun:V_REG_LDO: Voltage Regulator LDO Standard 150mA LDO voltage regulator in SOT-23 layout. Micrel part MIC5205. BP (by-pass) pin is used to lower output noise with 470pF cap.
X1 = NASA_LIB:TLA-6T118LF

## Net classes
1 power: width 0.61 mm, drill 0.711 mm, clearance 0.203 mm